# Altium schematic sheet PCIe_PEG_RST.SchDoc
size A3
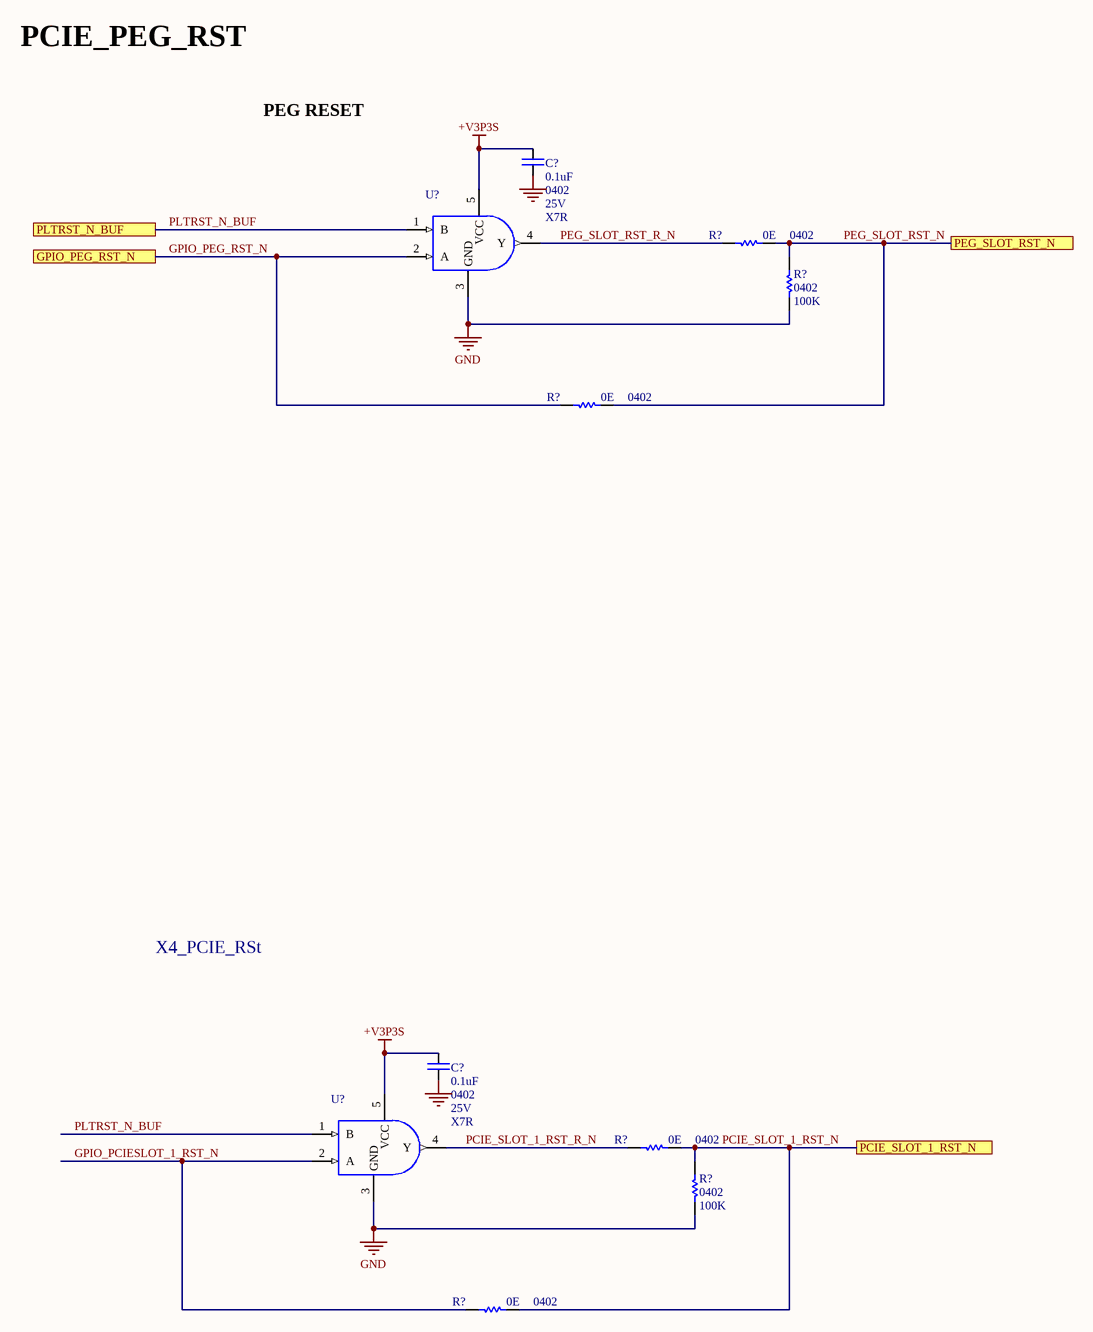
[diagram p0: PCIe_PEG_RST.SchDoc]

## Parts
(Parts that share a designator on the sheet are numbered #1, #2 ... from top to bottom, then left to right.)
C?#1  value 0.1uF  Case/Package: 0402  Voltage: 25V  Dielectric: X7R  [CAPC0402]
C?#2  value 0.1uF  Case/Package: 0402  Voltage: 25V  Dielectric: X7R  [CAPC0402]
R?#1  value 0E  Case/Package: 0402  [RESC0402]  (hidden comment: Res)
R?#2  value 100K  Case/Package: 0402  [RESC0402]  (hidden comment: Res)
R?#3  value 0E  Case/Package: 0402  [RESC0402]  (hidden comment: Res)
R?#4  value 0E  Case/Package: 0402  [RESC0402]  (hidden comment: Res)
R?#5  value 100K  Case/Package: 0402  [RESC0402]  (hidden comment: Res)
R?#6  value 0E  Case/Package: 0402  [RESC0402]  (hidden comment: Res)
U?#1  74AHC1G08GW,125  [SOT353]  (value not drawn)
U?#2  74AHC1G08GW,125  [SOT353]  (value not drawn)

## Ports
GPIO_PEG_RST_N, PCIE_SLOT_1_RST_N, PEG_SLOT_RST_N, PLTRST_N_BUF

## Nets
+V3P3S: C?#1.1 C?#2.1 U?#1.5(VCC) U?#2.5(VCC)
GND: C?#1.2 C?#2.2 R?#2.1 R?#5.1 U?#1.3(GND) U?#2.3(GND)
GPIO_PCIESLOT_1_RST_N: R?#6.1 U?#2.2(A)
GPIO_PEG_RST_N: R?#3.1 U?#1.2(A) ; port GPIO_PEG_RST_N
PCIE_SLOT_1_RST_N: R?#4.2 R?#5.2 R?#6.2 ; port PCIE_SLOT_1_RST_N
PCIE_SLOT_1_RST_R_N: R?#4.1 U?#2.4(Y)
PEG_SLOT_RST_N: R?#1.2 R?#2.2 R?#3.2 ; port PEG_SLOT_RST_N
PEG_SLOT_RST_R_N: R?#1.1 U?#1.4(Y)
PLTRST_N_BUF: U?#1.1(B) U?#2.1(B) ; port PLTRST_N_BUF

## Notes on the sheet
- PCIE_PEG_RST
- PEG RESET
- X4_PCIE_RSt

## Library data of the parts
C?#1 C?#2 = Cap: CAP CER 0.1uF 25V X7R 0402
R?#1 R?#3 R?#4 R?#6 = Res: Thick Film Resistor -  0ohm, 1%, 0402
  R?#3 R?#6: DNP: DNP
R?#2 R?#5 = Res: Thick Film Resistor - 100Kohm, 1%, 0402
U?#1 U?#2 = 74AHC1G08GW,125: Logic IC - Gate NXP Semiconductors 74AHC1G08GW, 125 AND gate 74AHC TSSOP 5; Manufacturer: Nexperia; Supplier 1: Digi-Key; Manufacturer Part Number: 74AHC1G08GW,125; Stock 1: 41783; Pricing 1: 1=0.27, 10=0.223, 25=0.1872, 100=0.1184, 250=0.0914, 500=0.0779, 1000=0.053 (USD); Case/Package: SOT-353; Supplier Part Number 1: 1727-3148-1-ND